# EAGLE schematic TZATZIKI_v6 (EAGLE 7.6.0)
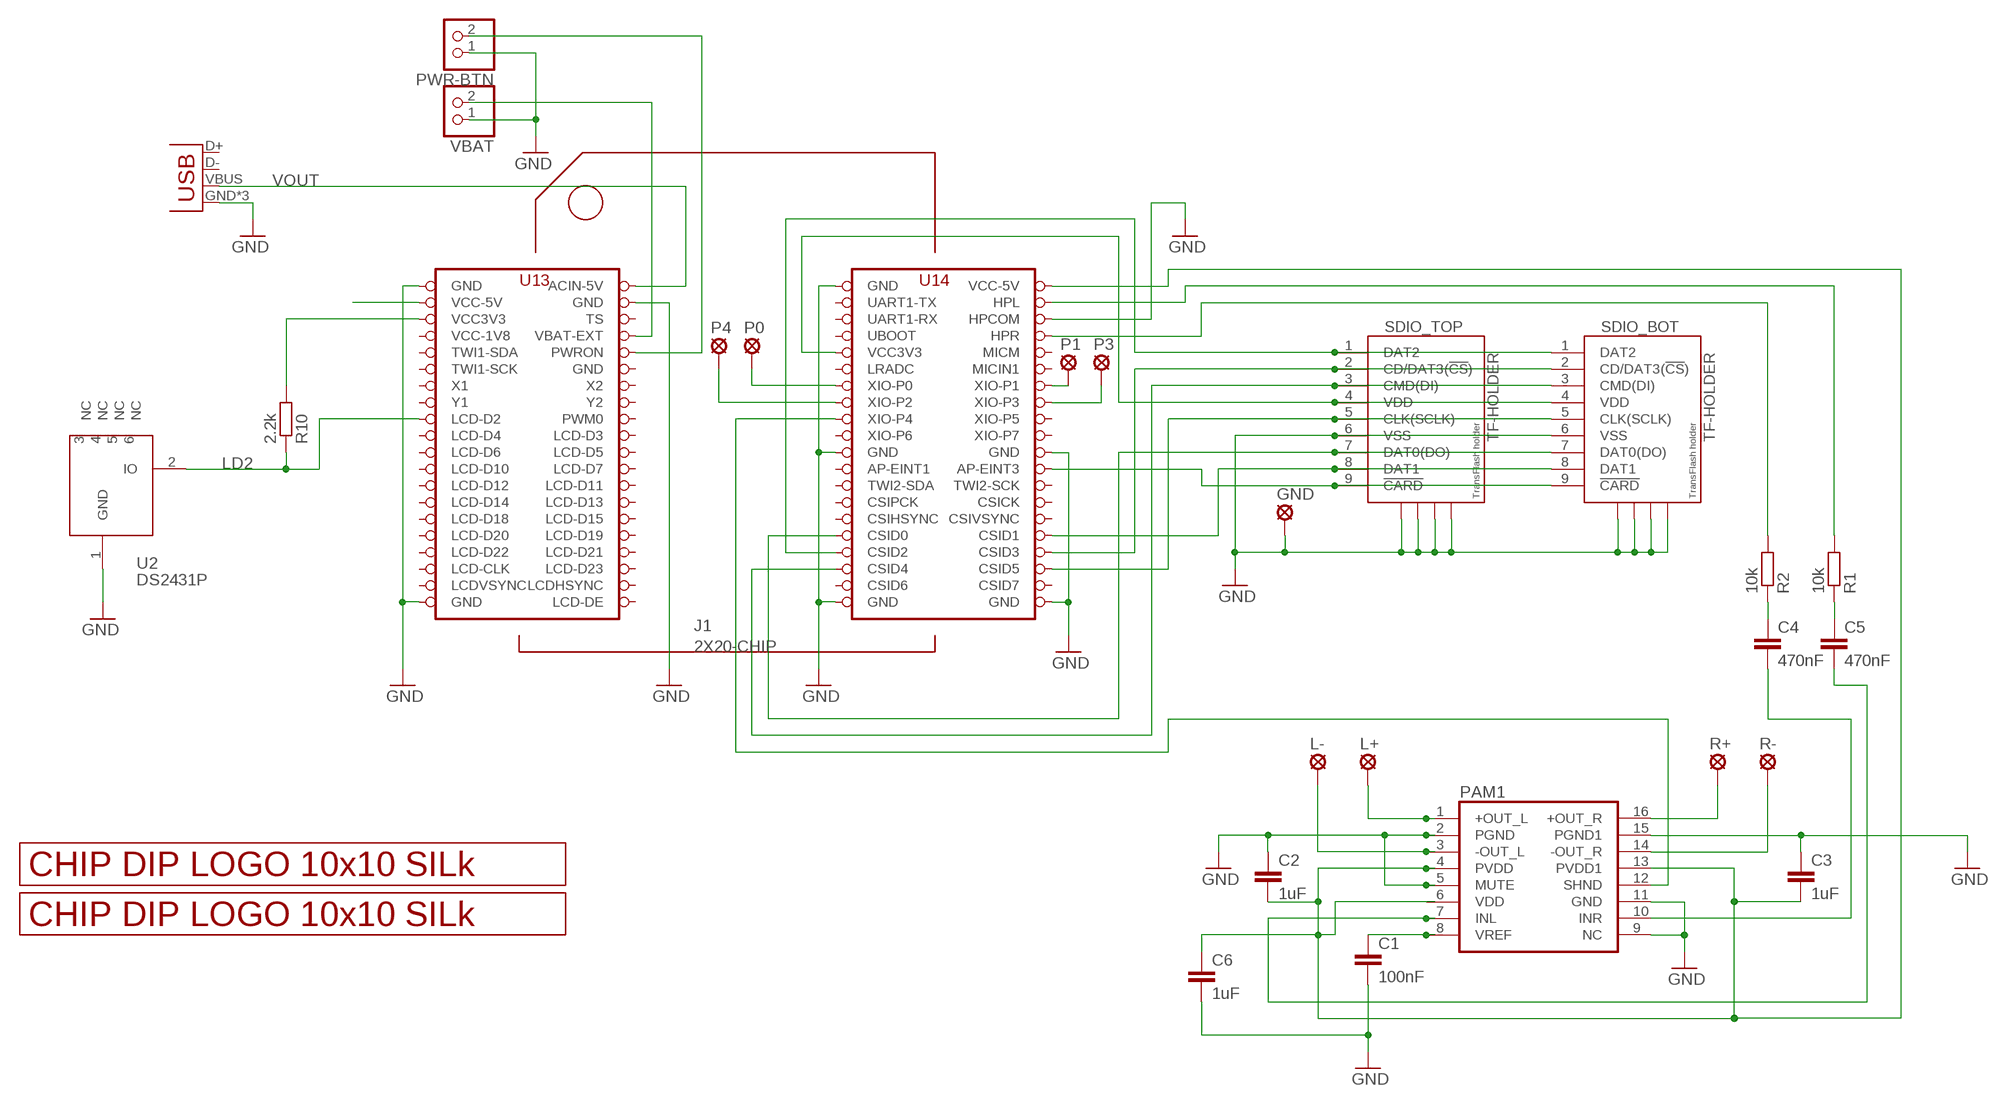
[diagram p0: schematic, sheet 1]

## Parts
C1  100nF  C-EUC0805  [C0805]
C2  1uF  C-EUC0805  [C0805]
C3  1uF  C-EUC0805  [C0805]
C4  470nF  C-EUC0805  [C0805]
C5  470nF  C-EUC0805  [C0805]
C6  1uF  C-EUC0805  [C0805]
GND  SE11  [SE11]
J1  2X20-CHIP  [2X20CHIP_OFFSET-TH]
L+  SE11  [SE11]
L-  SE11  [SE11]
P0  SE11  [SE11]
P1  SE11  [SE11]
P3  SE11  [SE11]
P4  SE11  [SE11]
PAM1  PAM8403  [SOP-16]
POWER_USB  USBUSB-MICROB-SMT-DIP  [USB-MICROB-SMT-DIP]
PWR-BTN  PINHD-1X2  [1X02]
R1  10k  R-EU_R0805  [R0805]
R2  10k  R-EU_R0805  [R0805]
R10  2.2k  R-EU_R0805  [R0805]
R+  SE11  [SE11]
R-  SE11  [SE11]
SDIO_BOT  TF-HOLDER  [TF-PULL]
SDIO_TOP  TF-HOLDER  [TF-PULL]
U2  DS2431P  [TSOC6]
U$1  LOGO_10X10_SILK  [LOGO_10X10_SILK]
U$2  LOGO_10X10_SILK  [LOGO_10X10_SILK]
VBAT  PINHD-1X2  [1X02]

## Nets
GND: C1.2 C2.1 C3.1 C6.2 GND.MP J1.GND@1(GND) J1.GND@2(GND) J1.GND@4(GND) J1.GND@5(GND) J1.GND@6(GND) J1.GND@7(GND) J1.GND@8(GND) J1.GND@10(GND) J1.HPCOM PAM1.2(PGND) PAM1.5(MUTE) PAM1.9(NC) PAM1.11(GND) PAM1.15(PGND1) POWER_USB.GND POWER_USB.MT1(GND) POWER_USB.MT2(GND) PWR-BTN.1 SDIO_BOT.6(VSS) SDIO_BOT.S1 SDIO_BOT.S2 SDIO_BOT.S3 SDIO_BOT.S4 SDIO_TOP.6(VSS) SDIO_TOP.S1 SDIO_TOP.S2 SDIO_TOP.S3 SDIO_TOP.S4 U2.1(GND) VBAT.1
LD2: J1.LCD-D2 R10.1 U2.2(IO)
N$1: J1.VCC3V3 R10.2
N$2: J1.CSID3 SDIO_BOT.2(CD/DAT3(!CS!)) SDIO_TOP.2(CD/DAT3(!CS!))
N$3: J1.CSID0 SDIO_BOT.7(DAT0(DO)) SDIO_TOP.7(DAT0(DO))
N$4: J1.CSID4 SDIO_BOT.3(CMD(DI)) SDIO_TOP.3(CMD(DI))
N$5: J1.CSID5 SDIO_BOT.5(CLK(SCLK)) SDIO_TOP.5(CLK(SCLK))
N$6: J1.CSID1 SDIO_BOT.8(DAT1) SDIO_TOP.8(DAT1)
N$7: C2.2 C3.2 C6.1 J1.VCC5V@1(VCC-5V) PAM1.4(PVDD) PAM1.6(VDD) PAM1.13(PVDD1)
N$8: J1.VCC5V@0(VCC-5V)
N$9: J1.CSID2 SDIO_BOT.1(DAT2) SDIO_TOP.1(DAT2)
N$10: J1.VCC3V3@1(VCC3V3) SDIO_BOT.4(VDD) SDIO_TOP.4(VDD)
N$11: L+.MP PAM1.1(+OUT_L)
N$12: L-.MP PAM1.3(-OUT_L)
N$13: PAM1.16(+OUT_R) R+.MP
N$14: PAM1.14(-OUT_R) R-.MP
N$15: C5.2 PAM1.7(INL)
N$16: J1.AP-EINT3 SDIO_BOT.9(!CARD) SDIO_TOP.9(!CARD)
N$17: J1.HPR R2.2
N$18: C4.2 PAM1.10(INR)
N$19: J1.HPL R1.2
N$20: C1.1 PAM1.8(VREF)
N$21: C4.1 R2.1
N$22: C5.1 R1.1
N$23: J1.XIO-P1 P1.MP
N$24: J1.XIO-P3 P3.MP
N$25: J1.XIO-P0 P0.MP
N$26: J1.XIO-P2 P4.MP
N$27: J1.XIO-P4 PAM1.12(SHND)
N$28: J1.BAT(VBAT-EXT) VBAT.2
N$29: J1.PWRON PWR-BTN.2
VOUT: J1.CHG-IN(ACIN-5V) POWER_USB.VBUS
Unconnected: J1.AP-EINT1 J1.CSICK J1.CSID6 J1.CSID7 J1.CSIHSYNC J1.CSIPCK J1.CSIVSYNC J1.FEL(UBOOT) J1.LCD-CLK J1.LCD-D3 J1.LCD-D4 J1.LCD-D5 J1.LCD-D6 J1.LCD-D7 J1.LCD-D10 J1.LCD-D11 J1.LCD-D12 J1.LCD-D13 J1.LCD-D14 J1.LCD-D15 J1.LCD-D18 J1.LCD-D19 J1.LCD-D20 J1.LCD-D21 J1.LCD-D22 J1.LCD-D23 J1.LCD-DE J1.LCD-HSYNC(LCDHSYNC) J1.LCD-VSYNC(LCDVSYNC) J1.LRADC J1.MICIN1 J1.MICM J1.PWM0 J1.TS J1.TWI1-SCK J1.TWI1-SDA J1.TWI2-SCK J1.TWI2-SDA J1.UART1-RX J1.UART1-TX J1.X1 J1.X2 J1.XIO-P5 J1.XIO-P6 J1.XIO-P7 J1.Y1 J1.Y2 POWER_USB.D+ POWER_USB.D- U2.3(NC) U2.4(NC) U2.5(NC) U2.6(NC)

## Power pins joined to a net without a drawn wire
GND: J1.GND@3(GND)
VCC-1V8: J1.VCC1V8(VCC-1V8)

## Library data of the parts
C1-C6 = rcl:C-EU: CAPACITOR, European symbol
GND L+ L- P0 P1 P3 P4 R+ R- = solpad:SE11: SOLDER PAD RTM, drill 1,1mm, distributor Buerklin, 07F810
J1 = JKW_CHIP:2X20-CHIP: Through hole layout with chip reference
PAM1 = JKW_CHIP:PAM8403: Dual channel audio amplifier IC - PAM8403
POWER_USB = Spark:USB
PWR-BTN VBAT = pinhead:PINHD-1X2: PIN HEADER
R1 R2 R10 = rcl:R-EU_: RESISTOR, European symbol
SDIO_BOT SDIO_TOP = JKW_CHIP:TF-HOLDER: TF / Micro SD socket is PUSH-PUSH type, the card can be pushed into and auto locked and pushed out by simply press the card. Surface Mounting type.
U2 = JKW_CHIP:DS2431: 1024-Bit EEPROM This chip provides a 4x256 Bit EEPROM, which can be programmed@5V. Write protection and OTP emulation are available, too. Author: Jan Kandziora <jjj@gmx.de>; DESCRIPTION: IC, 1024-Bit, 1-Wire EEPROM, TSOC6; FOOTPRINT: TSOC6; LINK: http://www.digikey.com/product-detail/en/DS2431P%2BT%26R/DS2431P%2BT%26RCT-ND/3647900; MFG: DIGIKEY; MFG_PN: DS2431P+T&RCT-ND; PART_TYPE: IC; PRICE: 0.98; VENDOR: MAXIM; VENDOR_PART_NUMBER: DS2431P+T&R
U$1 U$2 = JKW_CHIP:LOGO_10X10_SILK